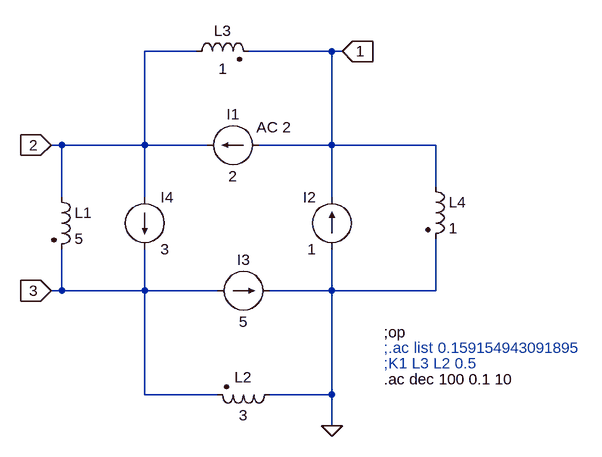
[diagram p0: schematic test_13.asc]
test_13.asc, the LTspice schematic file:
Version 4
SHEET 1 1288 680
WIRE 672 -400 592 -400
WIRE 880 -400 752 -400
WIRE 896 -400 880 -400
WIRE 464 -256 448 -256
WIRE 592 -256 592 -400
WIRE 592 -256 464 -256
WIRE 688 -256 592 -256
WIRE 880 -256 880 -400
WIRE 880 -256 768 -256
WIRE 1040 -256 880 -256
WIRE 1040 -192 1040 -256
WIRE 464 -176 464 -256
WIRE 592 -176 592 -256
WIRE 880 -176 880 -256
WIRE 464 -32 464 -96
WIRE 464 -32 448 -32
WIRE 592 -32 592 -96
WIRE 592 -32 464 -32
WIRE 704 -32 592 -32
WIRE 880 -32 880 -96
WIRE 880 -32 784 -32
WIRE 1040 -32 1040 -112
WIRE 1040 -32 880 -32
WIRE 592 128 592 -32
WIRE 704 128 592 128
WIRE 880 128 880 -32
WIRE 880 128 784 128
WIRE 880 176 880 128
FLAG 880 176 0
FLAG 448 -256 2
IOPIN 448 -256 In
FLAG 448 -32 3
IOPIN 448 -32 In
FLAG 896 -400 1
IOPIN 896 -400 In
SYMBOL ind2 448 -192 R0
SYMATTR InstName L1
SYMATTR Value 5
SYMATTR Type ind
SYMATTR SpiceLine Rser=0
SYMBOL current 768 -256 R90
WINDOW 0 -32 40 VBottom 2
WINDOW 3 32 40 VTop 2
WINDOW 123 -12 -23 VBottom 2
WINDOW 39 0 0 Left 0
SYMATTR InstName I1
SYMATTR Value 2
SYMATTR Value2 AC 2
SYMBOL ind2 800 112 R90
WINDOW 0 5 56 VBottom 2
WINDOW 3 32 56 VTop 2
SYMATTR InstName L2
SYMATTR Value 3
SYMATTR Type ind
SYMATTR SpiceLine Rser=0
SYMBOL ind2 656 -384 R270
WINDOW 0 32 56 VTop 2
WINDOW 3 5 56 VBottom 2
SYMATTR InstName L3
SYMATTR Value 1
SYMATTR Type ind
SYMATTR SpiceLine Rser=1e-20
SYMBOL ind2 1024 -208 R0
SYMATTR InstName L4
SYMATTR Value 1
SYMATTR SpiceLine Rser=0
SYMATTR Type ind
SYMBOL current 880 -96 R180
WINDOW 0 24 80 Left 2
WINDOW 3 24 0 Left 2
WINDOW 123 0 0 Left 0
WINDOW 39 0 0 Left 0
SYMATTR InstName I2
SYMATTR Value 1
SYMBOL current 704 -32 M90
WINDOW 0 -32 40 VBottom 2
WINDOW 3 32 40 VTop 2
WINDOW 123 0 0 Left 0
WINDOW 39 0 0 Left 0
SYMATTR InstName I3
SYMATTR Value 5
SYMBOL current 592 -176 R0
WINDOW 123 0 0 Left 0
WINDOW 39 0 0 Left 0
SYMATTR InstName I4
SYMATTR Value 3
TEXT 960 32 Left 2 !;op
TEXT 960 56 Left 2 ;;.ac list 0.159154943091895
TEXT 960 80 Left 2 ;;K1 L3 L2 0.5
TEXT 960 104 Left 2 !.ac dec 100 0.1 10

The netlist it stands for:
* test_13.asc
L1 2 3 5 Rser=0
I1 1 2 2 AC 2
L2 0 3 3 Rser=0
L3 2 1 1 Rser=1e-20
L4 1 0 1 Rser=0
I2 0 1 1
I3 3 0 5
I4 2 3 3
;op
* ;.ac list 0.159154943091895
* ;K1 L3 L2 0.5
.ac dec 100 0.1 10
.backanno
.end